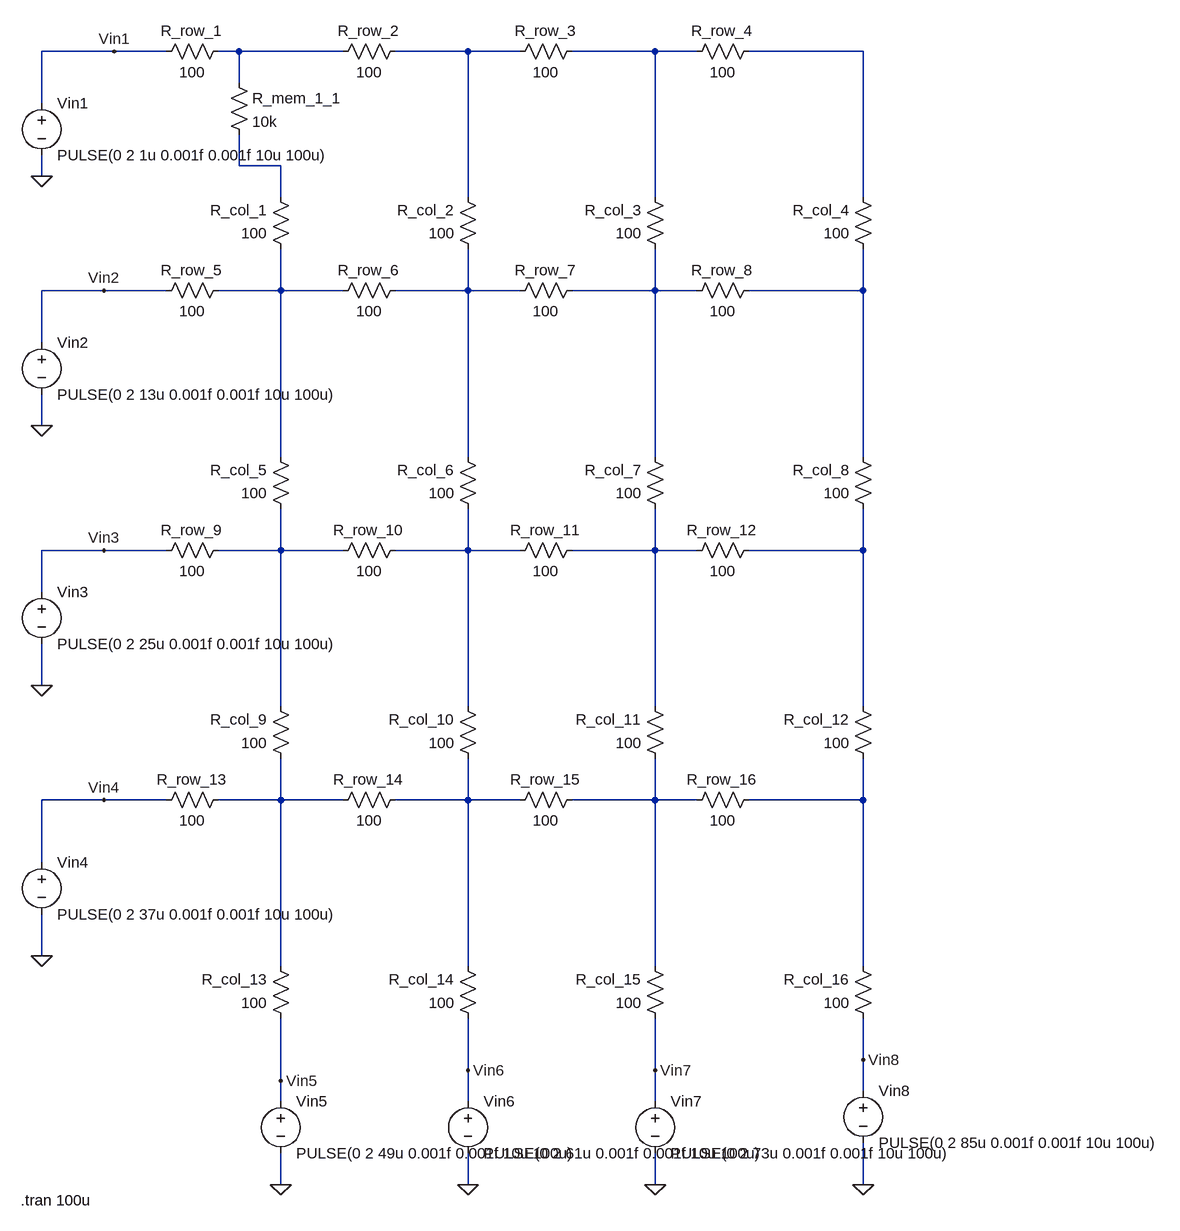
[diagram p0: schematic Memristor_new_1_1_10000_4_by_4.asc]
Memristor_new_1_1_10000_4_by_4.asc, the LTspice schematic file:
Version 4
SHEET 1 1752 1640
WIRE 112 -144 0 -144
WIRE 192 -144 112 -144
WIRE 304 -144 272 -144
WIRE 464 -144 304 -144
WIRE 656 -144 544 -144
WIRE 736 -144 656 -144
WIRE 944 -144 816 -144
WIRE 1008 -144 944 -144
WIRE 1264 -144 1088 -144
WIRE 304 -96 304 -144
WIRE 0 -64 0 -144
WIRE 304 32 304 -16
WIRE 368 32 304 32
WIRE 0 48 0 16
WIRE 368 80 368 32
WIRE 656 80 656 -144
WIRE 944 80 944 -144
WIRE 1264 80 1264 -144
WIRE 96 224 0 224
WIRE 192 224 96 224
WIRE 368 224 368 160
WIRE 368 224 272 224
WIRE 464 224 368 224
WIRE 656 224 656 160
WIRE 656 224 544 224
WIRE 736 224 656 224
WIRE 944 224 944 160
WIRE 944 224 816 224
WIRE 1008 224 944 224
WIRE 1264 224 1264 160
WIRE 1264 224 1088 224
WIRE 0 304 0 224
WIRE 0 432 0 384
WIRE 368 480 368 224
WIRE 656 480 656 224
WIRE 944 480 944 224
WIRE 1264 480 1264 224
WIRE 96 624 0 624
WIRE 192 624 96 624
WIRE 368 624 368 560
WIRE 368 624 272 624
WIRE 464 624 368 624
WIRE 656 624 656 560
WIRE 656 624 544 624
WIRE 736 624 656 624
WIRE 944 624 944 560
WIRE 944 624 816 624
WIRE 1008 624 944 624
WIRE 1264 624 1264 560
WIRE 1264 624 1088 624
WIRE 0 688 0 624
WIRE 0 832 0 768
WIRE 368 864 368 624
WIRE 656 864 656 624
WIRE 944 864 944 624
WIRE 1264 864 1264 624
WIRE 96 1008 0 1008
WIRE 192 1008 96 1008
WIRE 368 1008 368 944
WIRE 368 1008 272 1008
WIRE 464 1008 368 1008
WIRE 656 1008 656 944
WIRE 656 1008 544 1008
WIRE 736 1008 656 1008
WIRE 944 1008 944 944
WIRE 944 1008 816 1008
WIRE 1008 1008 944 1008
WIRE 1264 1008 1264 944
WIRE 1264 1008 1088 1008
WIRE 0 1104 0 1008
WIRE 0 1248 0 1184
WIRE 368 1264 368 1008
WIRE 656 1264 656 1008
WIRE 944 1264 944 1008
WIRE 1264 1264 1264 1008
WIRE 1264 1408 1264 1344
WIRE 656 1424 656 1344
WIRE 944 1424 944 1344
WIRE 368 1440 368 1344
WIRE 1264 1456 1264 1408
WIRE 368 1472 368 1440
WIRE 656 1472 656 1424
WIRE 944 1472 944 1424
WIRE 368 1600 368 1552
WIRE 656 1600 656 1552
WIRE 944 1600 944 1552
WIRE 1264 1600 1264 1536
FLAG 0 48 0
FLAG 0 432 0
FLAG 0 832 0
FLAG 0 1248 0
FLAG 368 1600 0
FLAG 656 1600 0
FLAG 944 1600 0
FLAG 1264 1600 0
FLAG 112 -144 Vin1
FLAG 96 224 Vin2
FLAG 96 624 Vin3
FLAG 96 1008 Vin4
FLAG 368 1440 Vin5
FLAG 656 1424 Vin6
FLAG 944 1424 Vin7
FLAG 1264 1408 Vin8
SYMBOL voltage 0 -80 R0
WINDOW 123 0 0 Left 0
WINDOW 39 0 0 Left 0
SYMATTR InstName Vin1
SYMATTR Value PULSE(0 2 1u 0.001f 0.001f 10u 100u)
SYMBOL voltage 0 288 R0
WINDOW 123 0 0 Left 0
WINDOW 39 0 0 Left 0
SYMATTR InstName Vin2
SYMATTR Value PULSE(0 2 13u 0.001f 0.001f 10u 100u)
SYMBOL voltage 0 672 R0
WINDOW 123 0 0 Left 0
WINDOW 39 0 0 Left 0
SYMATTR InstName Vin3
SYMATTR Value PULSE(0 2 25u 0.001f 0.001f 10u 100u)
SYMBOL voltage 0 1088 R0
WINDOW 123 0 0 Left 0
WINDOW 39 0 0 Left 0
SYMATTR InstName Vin4
SYMATTR Value PULSE(0 2 37u 0.001f 0.001f 10u 100u)
SYMBOL voltage 368 1456 R0
WINDOW 123 0 0 Left 0
WINDOW 39 0 0 Left 0
SYMATTR InstName Vin5
SYMATTR Value PULSE(0 2 49u 0.001f 0.001f 10u 100u)
SYMBOL voltage 656 1456 R0
WINDOW 123 0 0 Left 0
WINDOW 39 0 0 Left 0
SYMATTR InstName Vin6
SYMATTR Value PULSE(0 2 61u 0.001f 0.001f 10u 100u)
SYMBOL voltage 944 1456 R0
WINDOW 123 0 0 Left 0
WINDOW 39 0 0 Left 0
SYMATTR InstName Vin7
SYMATTR Value PULSE(0 2 73u 0.001f 0.001f 10u 100u)
SYMBOL voltage 1264 1440 R0
WINDOW 123 0 0 Left 0
WINDOW 39 0 0 Left 0
SYMATTR InstName Vin8
SYMATTR Value PULSE(0 2 85u 0.001f 0.001f 10u 100u)
SYMBOL res 288 -160 R90
WINDOW 0 0 56 VBottom 2
WINDOW 3 32 56 VTop 2
SYMATTR InstName R_row_1
SYMATTR Value 100
SYMBOL res 560 -160 R90
WINDOW 0 0 56 VBottom 2
WINDOW 3 32 56 VTop 2
SYMATTR InstName R_row_2
SYMATTR Value 100
SYMBOL res 832 -160 R90
WINDOW 0 0 56 VBottom 2
WINDOW 3 32 56 VTop 2
SYMATTR InstName R_row_3
SYMATTR Value 100
SYMBOL res 1104 -160 R90
WINDOW 0 0 56 VBottom 2
WINDOW 3 32 56 VTop 2
SYMATTR InstName R_row_4
SYMATTR Value 100
SYMBOL res 288 208 R90
WINDOW 0 0 56 VBottom 2
WINDOW 3 32 56 VTop 2
SYMATTR InstName R_row_5
SYMATTR Value 100
SYMBOL res 560 208 R90
WINDOW 0 0 56 VBottom 2
WINDOW 3 32 56 VTop 2
SYMATTR InstName R_row_6
SYMATTR Value 100
SYMBOL res 832 208 R90
WINDOW 0 0 56 VBottom 2
WINDOW 3 32 56 VTop 2
SYMATTR InstName R_row_7
SYMATTR Value 100
SYMBOL res 1104 208 R90
WINDOW 0 0 56 VBottom 2
WINDOW 3 32 56 VTop 2
SYMATTR InstName R_row_8
SYMATTR Value 100
SYMBOL res 288 608 R90
WINDOW 0 0 56 VBottom 2
WINDOW 3 32 56 VTop 2
SYMATTR InstName R_row_9
SYMATTR Value 100
SYMBOL res 560 608 R90
WINDOW 0 0 56 VBottom 2
WINDOW 3 32 56 VTop 2
SYMATTR InstName R_row_10
SYMATTR Value 100
SYMBOL res 832 608 R90
WINDOW 0 0 56 VBottom 2
WINDOW 3 32 56 VTop 2
SYMATTR InstName R_row_11
SYMATTR Value 100
SYMBOL res 1104 608 R90
WINDOW 0 0 56 VBottom 2
WINDOW 3 32 56 VTop 2
SYMATTR InstName R_row_12
SYMATTR Value 100
SYMBOL res 288 992 R90
WINDOW 0 0 56 VBottom 2
WINDOW 3 32 56 VTop 2
SYMATTR InstName R_row_13
SYMATTR Value 100
SYMBOL res 560 992 R90
WINDOW 0 0 56 VBottom 2
WINDOW 3 32 56 VTop 2
SYMATTR InstName R_row_14
SYMATTR Value 100
SYMBOL res 832 992 R90
WINDOW 0 0 56 VBottom 2
WINDOW 3 32 56 VTop 2
SYMATTR InstName R_row_15
SYMATTR Value 100
SYMBOL res 1104 992 R90
WINDOW 0 0 56 VBottom 2
WINDOW 3 32 56 VTop 2
SYMATTR InstName R_row_16
SYMATTR Value 100
SYMBOL res 384 176 R180
WINDOW 0 36 76 Left 2
WINDOW 3 36 40 Left 2
SYMATTR InstName R_col_1
SYMATTR Value 100
SYMBOL res 672 176 R180
WINDOW 0 36 76 Left 2
WINDOW 3 36 40 Left 2
SYMATTR InstName R_col_2
SYMATTR Value 100
SYMBOL res 960 176 R180
WINDOW 0 36 76 Left 2
WINDOW 3 36 40 Left 2
SYMATTR InstName R_col_3
SYMATTR Value 100
SYMBOL res 1280 176 R180
WINDOW 0 36 76 Left 2
WINDOW 3 36 40 Left 2
SYMATTR InstName R_col_4
SYMATTR Value 100
SYMBOL res 384 576 R180
WINDOW 0 36 76 Left 2
WINDOW 3 36 40 Left 2
SYMATTR InstName R_col_5
SYMATTR Value 100
SYMBOL res 672 576 R180
WINDOW 0 36 76 Left 2
WINDOW 3 36 40 Left 2
SYMATTR InstName R_col_6
SYMATTR Value 100
SYMBOL res 960 576 R180
WINDOW 0 36 76 Left 2
WINDOW 3 36 40 Left 2
SYMATTR InstName R_col_7
SYMATTR Value 100
SYMBOL res 1280 576 R180
WINDOW 0 36 76 Left 2
WINDOW 3 36 40 Left 2
SYMATTR InstName R_col_8
SYMATTR Value 100
SYMBOL res 384 960 R180
WINDOW 0 36 76 Left 2
WINDOW 3 36 40 Left 2
SYMATTR InstName R_col_9
SYMATTR Value 100
SYMBOL res 672 960 R180
WINDOW 0 36 76 Left 2
WINDOW 3 36 40 Left 2
SYMATTR InstName R_col_10
SYMATTR Value 100
SYMBOL res 960 960 R180
WINDOW 0 36 76 Left 2
WINDOW 3 36 40 Left 2
SYMATTR InstName R_col_11
SYMATTR Value 100
SYMBOL res 1280 960 R180
WINDOW 0 36 76 Left 2
WINDOW 3 36 40 Left 2
SYMATTR InstName R_col_12
SYMATTR Value 100
SYMBOL res 384 1360 R180
WINDOW 0 36 76 Left 2
WINDOW 3 36 40 Left 2
SYMATTR InstName R_col_13
SYMATTR Value 100
SYMBOL res 672 1360 R180
WINDOW 0 36 76 Left 2
WINDOW 3 36 40 Left 2
SYMATTR InstName R_col_14
SYMATTR Value 100
SYMBOL res 960 1360 R180
WINDOW 0 36 76 Left 2
WINDOW 3 36 40 Left 2
SYMATTR InstName R_col_15
SYMATTR Value 100
SYMBOL res 1280 1360 R180
WINDOW 0 36 76 Left 2
WINDOW 3 36 40 Left 2
SYMATTR InstName R_col_16
SYMATTR Value 100
SYMBOL res 288 -112 R0
SYMATTR InstName R_mem_1_1
SYMATTR Value 10k
TEXT -32 1624 Left 2 !.tran 100u

The netlist it stands for:
* Memristor_new_1_1_10000_4_by_4.asc
Vin1 Vin1 0 PULSE(0 2 1u 0.001f 0.001f 10u 100u)
Vin2 Vin2 0 PULSE(0 2 13u 0.001f 0.001f 10u 100u)
Vin3 Vin3 0 PULSE(0 2 25u 0.001f 0.001f 10u 100u)
Vin4 Vin4 0 PULSE(0 2 37u 0.001f 0.001f 10u 100u)
Vin5 Vin5 0 PULSE(0 2 49u 0.001f 0.001f 10u 100u)
Vin6 Vin6 0 PULSE(0 2 61u 0.001f 0.001f 10u 100u)
Vin7 Vin7 0 PULSE(0 2 73u 0.001f 0.001f 10u 100u)
Vin8 Vin8 0 PULSE(0 2 85u 0.001f 0.001f 10u 100u)
R_row_1 N001 Vin1 100
R_row_2 N002 N001 100
R_row_3 N003 N002 100
R_row_4 N004 N003 100
R_row_5 N006 Vin2 100
R_row_6 N007 N006 100
R_row_7 N008 N007 100
R_row_8 N009 N008 100
R_row_9 N010 Vin3 100
R_row_10 N011 N010 100
R_row_11 N012 N011 100
R_row_12 N013 N012 100
R_row_13 N014 Vin4 100
R_row_14 N015 N014 100
R_row_15 N016 N015 100
R_row_16 N017 N016 100
R_col_1 N006 N005 100
R_col_2 N007 N002 100
R_col_3 N008 N003 100
R_col_4 N009 N004 100
R_col_5 N010 N006 100
R_col_6 N011 N007 100
R_col_7 N012 N008 100
R_col_8 N013 N009 100
R_col_9 N014 N010 100
R_col_10 N015 N011 100
R_col_11 N016 N012 100
R_col_12 N017 N013 100
R_col_13 Vin5 N014 100
R_col_14 Vin6 N015 100
R_col_15 Vin7 N016 100
R_col_16 Vin8 N017 100
R_mem_1_1 N001 N005 10k
.tran 100u
.backanno
.end